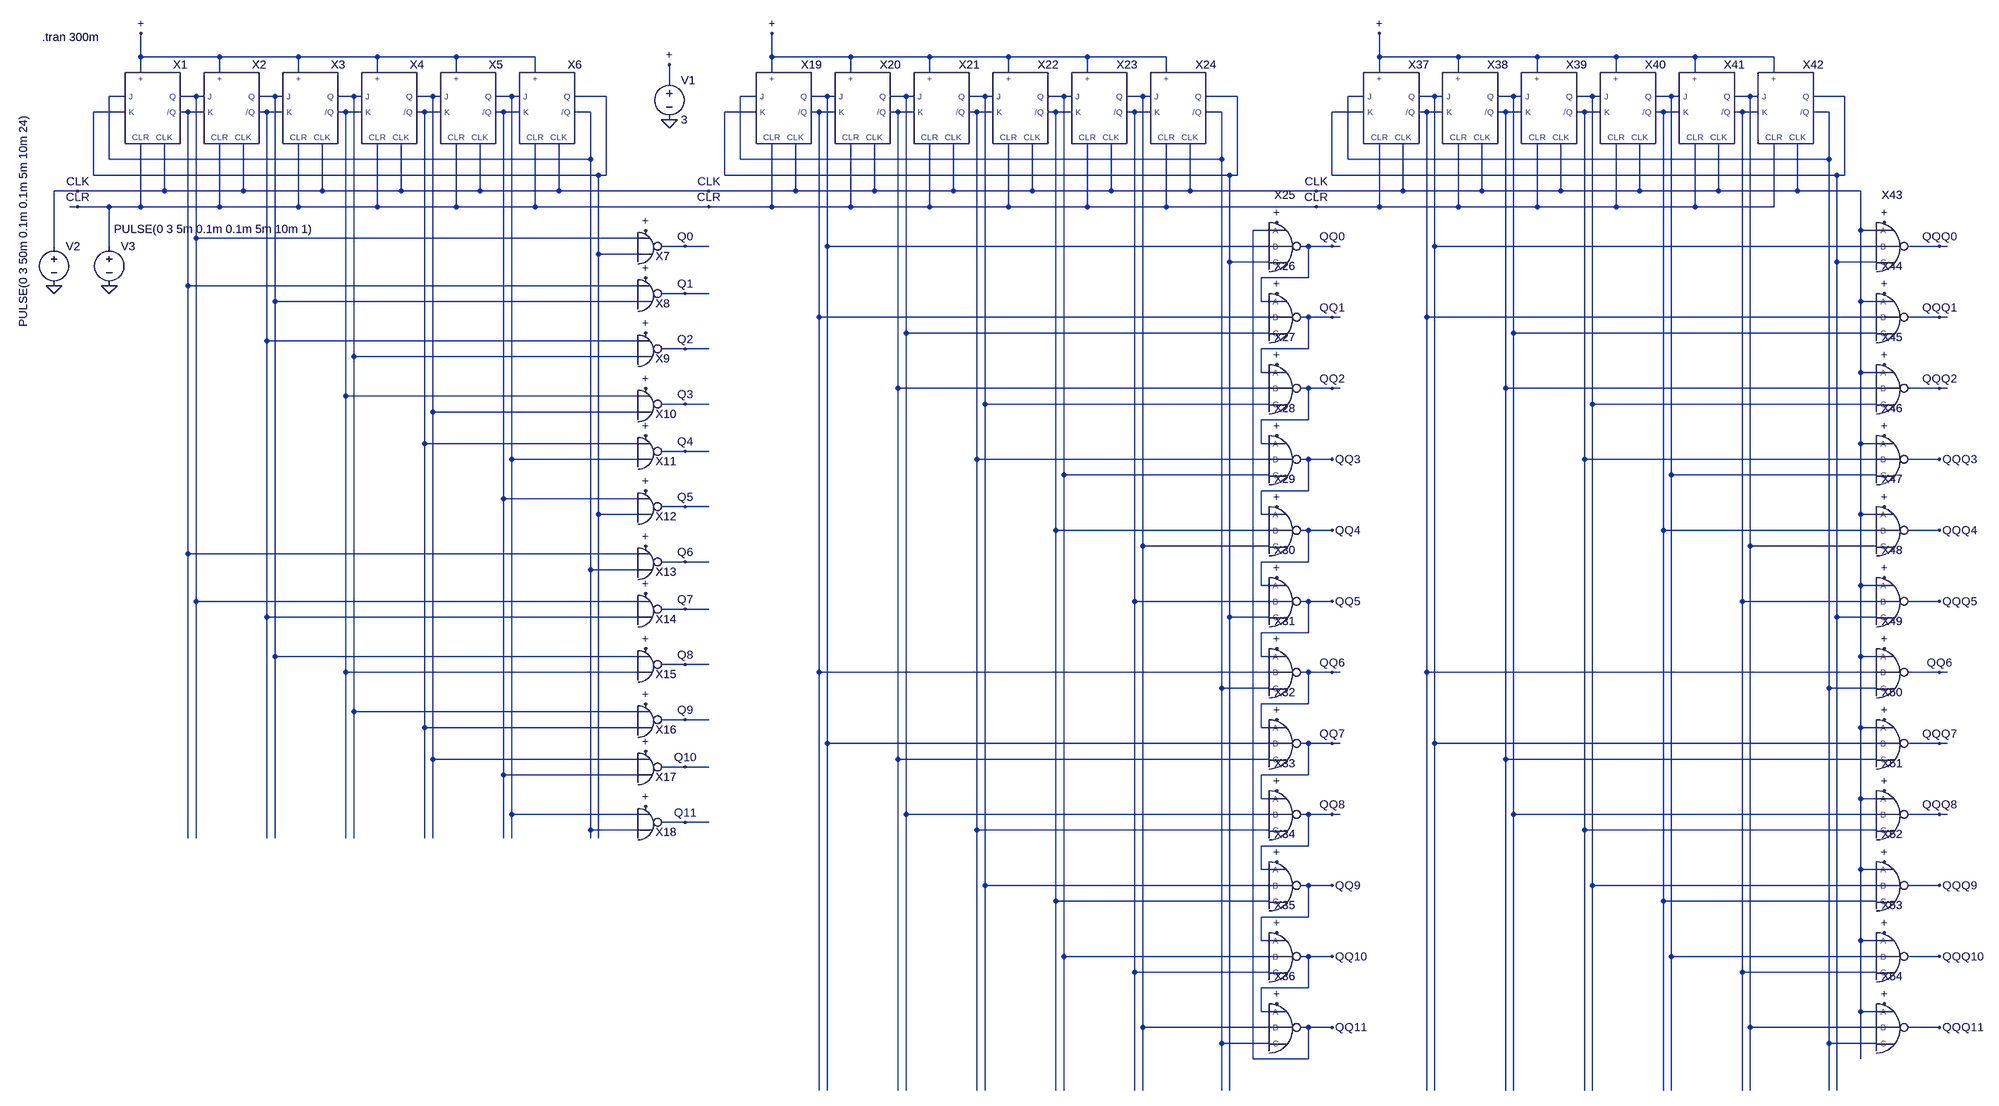
[diagram p0: schematic Jonsson12.asc]
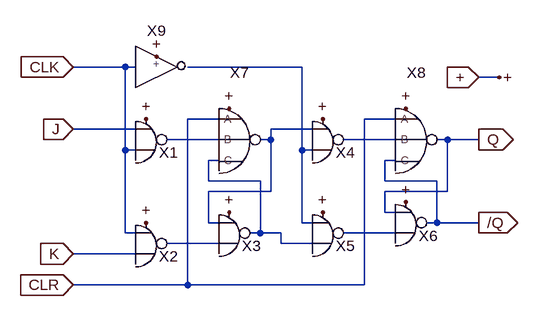
[diagram p1: sub-circuit jonsson.asc]
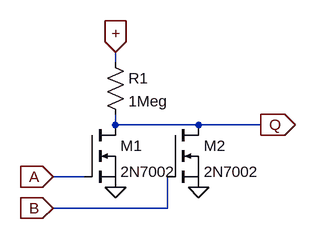
[diagram p2: sub-circuit nor2.asc]
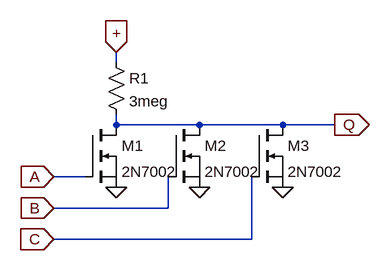
[diagram p3: sub-circuit nor3.asc]
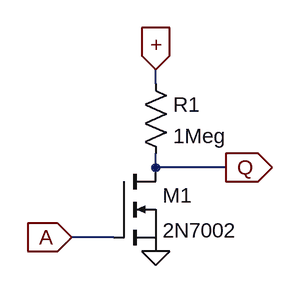
[diagram p4: sub-circuit inv.asc]
Jonsson12.asc, the LTspice schematic file:
Version 4
SHEET 1 3916 2276
WIRE 176 176 176 128
WIRE 336 176 176 176
WIRE 496 176 336 176
WIRE 656 176 496 176
WIRE 816 176 656 176
WIRE 976 176 816 176
WIRE 1456 176 1456 128
WIRE 1616 176 1456 176
WIRE 1776 176 1616 176
WIRE 1936 176 1776 176
WIRE 2096 176 1936 176
WIRE 2256 176 2096 176
WIRE 2688 176 2688 128
WIRE 2848 176 2688 176
WIRE 3008 176 2848 176
WIRE 3168 176 3008 176
WIRE 3328 176 3168 176
WIRE 3488 176 3328 176
WIRE 176 208 176 176
WIRE 336 208 336 176
WIRE 496 208 496 176
WIRE 656 208 656 176
WIRE 816 208 816 176
WIRE 976 208 976 176
WIRE 1456 208 1456 176
WIRE 1616 208 1616 176
WIRE 1776 208 1776 176
WIRE 1936 208 1936 176
WIRE 2096 208 2096 176
WIRE 2256 208 2256 176
WIRE 2688 208 2688 176
WIRE 2848 208 2848 176
WIRE 3008 208 3008 176
WIRE 3168 208 3168 176
WIRE 3328 208 3328 176
WIRE 3488 208 3488 176
WIRE 1248 224 1248 192
WIRE 144 256 112 256
WIRE 288 256 256 256
WIRE 304 256 288 256
WIRE 448 256 416 256
WIRE 464 256 448 256
WIRE 608 256 576 256
WIRE 624 256 608 256
WIRE 768 256 736 256
WIRE 784 256 768 256
WIRE 928 256 896 256
WIRE 944 256 928 256
WIRE 1120 256 1056 256
WIRE 1424 256 1392 256
WIRE 1568 256 1536 256
WIRE 1584 256 1568 256
WIRE 1728 256 1696 256
WIRE 1744 256 1728 256
WIRE 1888 256 1856 256
WIRE 1904 256 1888 256
WIRE 2048 256 2016 256
WIRE 2064 256 2048 256
WIRE 2208 256 2176 256
WIRE 2224 256 2208 256
WIRE 2400 256 2336 256
WIRE 2656 256 2624 256
WIRE 2800 256 2768 256
WIRE 2816 256 2800 256
WIRE 2960 256 2928 256
WIRE 2976 256 2960 256
WIRE 3120 256 3088 256
WIRE 3136 256 3120 256
WIRE 3280 256 3248 256
WIRE 3296 256 3280 256
WIRE 3440 256 3408 256
WIRE 3456 256 3440 256
WIRE 3632 256 3568 256
WIRE 144 288 80 288
WIRE 272 288 256 288
WIRE 304 288 272 288
WIRE 432 288 416 288
WIRE 464 288 432 288
WIRE 592 288 576 288
WIRE 624 288 592 288
WIRE 752 288 736 288
WIRE 784 288 752 288
WIRE 912 288 896 288
WIRE 944 288 912 288
WIRE 1088 288 1056 288
WIRE 1424 288 1360 288
WIRE 1552 288 1536 288
WIRE 1584 288 1552 288
WIRE 1712 288 1696 288
WIRE 1744 288 1712 288
WIRE 1872 288 1856 288
WIRE 1904 288 1872 288
WIRE 2032 288 2016 288
WIRE 2064 288 2032 288
WIRE 2192 288 2176 288
WIRE 2224 288 2192 288
WIRE 2368 288 2336 288
WIRE 2656 288 2592 288
WIRE 2784 288 2768 288
WIRE 2816 288 2784 288
WIRE 2944 288 2928 288
WIRE 2976 288 2944 288
WIRE 3104 288 3088 288
WIRE 3136 288 3104 288
WIRE 3264 288 3248 288
WIRE 3296 288 3264 288
WIRE 3424 288 3408 288
WIRE 3456 288 3424 288
WIRE 3600 288 3568 288
WIRE 112 384 112 256
WIRE 1088 384 1088 288
WIRE 1088 384 112 384
WIRE 1392 384 1392 256
WIRE 2368 384 2368 288
WIRE 2368 384 1392 384
WIRE 2624 384 2624 256
WIRE 3600 384 3600 288
WIRE 3600 384 2624 384
WIRE 80 416 80 288
WIRE 1104 416 80 416
WIRE 1120 416 1120 256
WIRE 1120 416 1104 416
WIRE 1360 416 1360 288
WIRE 2384 416 1360 416
WIRE 2400 416 2400 256
WIRE 2400 416 2384 416
WIRE 2592 416 2592 288
WIRE 3616 416 2592 416
WIRE 3632 416 3632 256
WIRE 3632 416 3616 416
WIRE 48 448 0 448
WIRE 224 448 224 352
WIRE 224 448 48 448
WIRE 384 448 384 352
WIRE 384 448 224 448
WIRE 544 448 544 352
WIRE 544 448 384 448
WIRE 704 448 704 352
WIRE 704 448 544 448
WIRE 864 448 864 352
WIRE 864 448 704 448
WIRE 1024 448 1024 352
WIRE 1024 448 864 448
WIRE 1328 448 1024 448
WIRE 1504 448 1504 352
WIRE 1504 448 1328 448
WIRE 1664 448 1664 352
WIRE 1664 448 1504 448
WIRE 1824 448 1824 352
WIRE 1824 448 1664 448
WIRE 1984 448 1984 352
WIRE 1984 448 1824 448
WIRE 2144 448 2144 352
WIRE 2144 448 1984 448
WIRE 2304 448 2304 352
WIRE 2304 448 2144 448
WIRE 2560 448 2304 448
WIRE 2736 448 2736 352
WIRE 2736 448 2560 448
WIRE 2896 448 2896 352
WIRE 2896 448 2736 448
WIRE 3056 448 3056 352
WIRE 3056 448 2896 448
WIRE 3216 448 3216 352
WIRE 3216 448 3056 448
WIRE 3376 448 3376 352
WIRE 3376 448 3216 448
WIRE 3536 448 3536 352
WIRE 3536 448 3376 448
WIRE 3664 448 3536 448
WIRE 48 480 32 480
WIRE 112 480 48 480
WIRE 176 480 176 352
WIRE 176 480 112 480
WIRE 336 480 336 352
WIRE 336 480 176 480
WIRE 496 480 496 352
WIRE 496 480 336 480
WIRE 656 480 656 352
WIRE 656 480 496 480
WIRE 816 480 816 352
WIRE 816 480 656 480
WIRE 976 480 976 352
WIRE 976 480 816 480
WIRE 1328 480 976 480
WIRE 1456 480 1456 352
WIRE 1456 480 1328 480
WIRE 1616 480 1616 352
WIRE 1616 480 1456 480
WIRE 1776 480 1776 352
WIRE 1776 480 1616 480
WIRE 1936 480 1936 352
WIRE 1936 480 1776 480
WIRE 2096 480 2096 352
WIRE 2096 480 1936 480
WIRE 2256 480 2256 352
WIRE 2256 480 2096 480
WIRE 2560 480 2256 480
WIRE 2688 480 2688 352
WIRE 2688 480 2560 480
WIRE 2848 480 2848 352
WIRE 2848 480 2688 480
WIRE 3008 480 3008 352
WIRE 3008 480 2848 480
WIRE 3168 480 3168 352
WIRE 3168 480 3008 480
WIRE 3328 480 3328 352
WIRE 3328 480 3168 480
WIRE 3488 480 3488 352
WIRE 3488 480 3328 480
WIRE 2464 528 2432 528
WIRE 3664 528 3664 448
WIRE 3696 528 3664 528
WIRE 288 544 288 256
WIRE 1184 544 288 544
WIRE 0 560 0 448
WIRE 112 560 112 480
WIRE 1280 560 1232 560
WIRE 1328 560 1280 560
WIRE 1568 560 1568 256
WIRE 2464 560 1568 560
WIRE 2544 560 2528 560
WIRE 2592 560 2544 560
WIRE 2608 560 2592 560
WIRE 2800 560 2800 256
WIRE 3696 560 2800 560
WIRE 3824 560 3760 560
WIRE 3840 560 3824 560
WIRE 1104 576 1104 416
WIRE 1184 576 1104 576
WIRE 2384 592 2384 416
WIRE 2464 592 2384 592
WIRE 3616 592 3616 416
WIRE 3696 592 3616 592
WIRE 2544 624 2544 560
WIRE 2544 624 2448 624
WIRE 272 640 272 288
WIRE 1184 640 272 640
WIRE 1280 656 1232 656
WIRE 1328 656 1280 656
WIRE 448 672 448 256
WIRE 1184 672 448 672
WIRE 2448 672 2448 624
WIRE 2464 672 2448 672
WIRE 3664 672 3664 528
WIRE 3696 672 3664 672
WIRE 1552 704 1552 288
WIRE 2464 704 1552 704
WIRE 2544 704 2528 704
WIRE 2592 704 2544 704
WIRE 2608 704 2592 704
WIRE 2784 704 2784 288
WIRE 3696 704 2784 704
WIRE 3824 704 3760 704
WIRE 3840 704 3824 704
WIRE 1728 736 1728 256
WIRE 2464 736 1728 736
WIRE 2960 736 2960 256
WIRE 3696 736 2960 736
WIRE 432 752 432 288
WIRE 1184 752 432 752
WIRE 1280 768 1232 768
WIRE 1328 768 1280 768
WIRE 2544 768 2544 704
WIRE 2544 768 2448 768
WIRE 608 784 608 256
WIRE 1184 784 608 784
WIRE 2448 816 2448 768
WIRE 2464 816 2448 816
WIRE 3664 816 3664 672
WIRE 3696 816 3664 816
WIRE 1712 848 1712 288
WIRE 2464 848 1712 848
WIRE 2544 848 2528 848
WIRE 2592 848 2544 848
WIRE 2608 848 2592 848
WIRE 2944 848 2944 288
WIRE 3696 848 2944 848
WIRE 3824 848 3760 848
WIRE 3840 848 3824 848
WIRE 592 864 592 288
WIRE 1184 864 592 864
WIRE 1280 880 1232 880
WIRE 1328 880 1280 880
WIRE 1888 880 1888 256
WIRE 2464 880 1888 880
WIRE 3120 880 3120 256
WIRE 3696 880 3120 880
WIRE 768 896 768 256
WIRE 1184 896 768 896
WIRE 2544 912 2544 848
WIRE 2544 912 2448 912
WIRE 752 960 752 288
WIRE 1184 960 752 960
WIRE 2448 960 2448 912
WIRE 2464 960 2448 960
WIRE 3664 960 3664 816
WIRE 3696 960 3664 960
WIRE 1280 976 1232 976
WIRE 1328 976 1280 976
WIRE 928 992 928 256
WIRE 1184 992 928 992
WIRE 1872 992 1872 288
WIRE 2464 992 1872 992
WIRE 2544 992 2528 992
WIRE 2592 992 2544 992
WIRE 3104 992 3104 288
WIRE 3696 992 3104 992
WIRE 3824 992 3760 992
WIRE 2048 1024 2048 256
WIRE 2464 1024 2048 1024
WIRE 3280 1024 3280 256
WIRE 3696 1024 3280 1024
WIRE 2544 1056 2544 992
WIRE 2544 1056 2448 1056
WIRE 912 1072 912 288
WIRE 1184 1072 912 1072
WIRE 1280 1088 1232 1088
WIRE 1328 1088 1280 1088
WIRE 1104 1104 1104 576
WIRE 1184 1104 1104 1104
WIRE 2448 1104 2448 1056
WIRE 2464 1104 2448 1104
WIRE 3664 1104 3664 960
WIRE 3696 1104 3664 1104
WIRE 2032 1136 2032 288
WIRE 2464 1136 2032 1136
WIRE 2544 1136 2528 1136
WIRE 2592 1136 2544 1136
WIRE 3264 1136 3264 288
WIRE 3696 1136 3264 1136
WIRE 3824 1136 3760 1136
WIRE 2208 1168 2208 256
WIRE 2464 1168 2208 1168
WIRE 3440 1168 3440 256
WIRE 3696 1168 3440 1168
WIRE 272 1184 272 640
WIRE 1184 1184 272 1184
WIRE 1280 1200 1232 1200
WIRE 1328 1200 1280 1200
WIRE 2544 1200 2544 1136
WIRE 2544 1200 2448 1200
WIRE 1088 1216 1088 384
WIRE 1184 1216 1088 1216
WIRE 2448 1248 2448 1200
WIRE 2464 1248 2448 1248
WIRE 3664 1248 3664 1104
WIRE 3696 1248 3664 1248
WIRE 288 1280 288 544
WIRE 1184 1280 288 1280
WIRE 2192 1280 2192 288
WIRE 2464 1280 2192 1280
WIRE 2544 1280 2528 1280
WIRE 2592 1280 2544 1280
WIRE 3424 1280 3424 288
WIRE 3696 1280 3424 1280
WIRE 3824 1280 3760 1280
WIRE 1280 1296 1232 1296
WIRE 1328 1296 1280 1296
WIRE 432 1312 432 752
WIRE 1184 1312 432 1312
WIRE 2384 1312 2384 592
WIRE 2464 1312 2384 1312
WIRE 3616 1312 3616 592
WIRE 3696 1312 3616 1312
WIRE 2544 1344 2544 1280
WIRE 2544 1344 2448 1344
WIRE 448 1392 448 672
WIRE 1184 1392 448 1392
WIRE 2448 1392 2448 1344
WIRE 2464 1392 2448 1392
WIRE 3664 1392 3664 1248
WIRE 3696 1392 3664 1392
WIRE 1280 1408 1232 1408
WIRE 1328 1408 1280 1408
WIRE 592 1424 592 864
WIRE 1184 1424 592 1424
WIRE 1552 1424 1552 704
WIRE 2464 1424 1552 1424
WIRE 2544 1424 2528 1424
WIRE 2592 1424 2544 1424
WIRE 2608 1424 2592 1424
WIRE 2784 1424 2784 704
WIRE 3696 1424 2784 1424
WIRE 3824 1424 3760 1424
WIRE 3840 1424 3824 1424
WIRE 2368 1456 2368 384
WIRE 2464 1456 2368 1456
WIRE 3600 1456 3600 384
WIRE 3696 1456 3600 1456
WIRE 2544 1488 2544 1424
WIRE 2544 1488 2448 1488
WIRE 608 1504 608 784
WIRE 1184 1504 608 1504
WIRE 1280 1520 1232 1520
WIRE 1328 1520 1280 1520
WIRE 752 1536 752 960
WIRE 1184 1536 752 1536
WIRE 2448 1536 2448 1488
WIRE 2464 1536 2448 1536
WIRE 3664 1536 3664 1392
WIRE 3696 1536 3664 1536
WIRE 1568 1568 1568 560
WIRE 2464 1568 1568 1568
WIRE 2544 1568 2528 1568
WIRE 2592 1568 2544 1568
WIRE 2608 1568 2592 1568
WIRE 2800 1568 2800 560
WIRE 3696 1568 2800 1568
WIRE 3824 1568 3760 1568
WIRE 3840 1568 3824 1568
WIRE 768 1600 768 896
WIRE 1184 1600 768 1600
WIRE 1712 1600 1712 848
WIRE 2464 1600 1712 1600
WIRE 2944 1600 2944 848
WIRE 3696 1600 2944 1600
WIRE 1280 1616 1232 1616
WIRE 1328 1616 1280 1616
WIRE 912 1632 912 1072
WIRE 1184 1632 912 1632
WIRE 2544 1632 2544 1568
WIRE 2544 1632 2448 1632
WIRE 2448 1680 2448 1632
WIRE 2464 1680 2448 1680
WIRE 3664 1680 3664 1536
WIRE 3696 1680 3664 1680
WIRE 928 1712 928 992
WIRE 1184 1712 928 1712
WIRE 1728 1712 1728 736
WIRE 2464 1712 1728 1712
WIRE 2544 1712 2528 1712
WIRE 2592 1712 2544 1712
WIRE 2608 1712 2592 1712
WIRE 2960 1712 2960 736
WIRE 3696 1712 2960 1712
WIRE 3824 1712 3760 1712
WIRE 3840 1712 3824 1712
WIRE 1280 1728 1232 1728
WIRE 1328 1728 1280 1728
WIRE 1088 1744 1088 1216
WIRE 1184 1744 1088 1744
WIRE 1872 1744 1872 992
WIRE 2464 1744 1872 1744
WIRE 3104 1744 3104 992
WIRE 3696 1744 3104 1744
WIRE 272 1760 272 1184
WIRE 288 1760 288 1280
WIRE 432 1760 432 1312
WIRE 448 1760 448 1392
WIRE 592 1760 592 1424
WIRE 608 1760 608 1504
WIRE 752 1760 752 1536
WIRE 768 1760 768 1600
WIRE 912 1760 912 1632
WIRE 928 1760 928 1712
WIRE 1088 1760 1088 1744
WIRE 1104 1760 1104 1104
WIRE 2544 1776 2544 1712
WIRE 2544 1776 2448 1776
WIRE 2448 1824 2448 1776
WIRE 2464 1824 2448 1824
WIRE 3664 1824 3664 1680
WIRE 3696 1824 3664 1824
WIRE 1888 1856 1888 880
WIRE 2464 1856 1888 1856
WIRE 2544 1856 2528 1856
WIRE 2592 1856 2544 1856
WIRE 3120 1856 3120 880
WIRE 3696 1856 3120 1856
WIRE 3824 1856 3760 1856
WIRE 2032 1888 2032 1136
WIRE 2464 1888 2032 1888
WIRE 3264 1888 3264 1136
WIRE 3696 1888 3264 1888
WIRE 2544 1920 2544 1856
WIRE 2544 1920 2448 1920
WIRE 2448 1968 2448 1920
WIRE 2464 1968 2448 1968
WIRE 3664 1968 3664 1824
WIRE 3696 1968 3664 1968
WIRE 2048 2000 2048 1024
WIRE 2464 2000 2048 2000
WIRE 2544 2000 2528 2000
WIRE 2592 2000 2544 2000
WIRE 3280 2000 3280 1024
WIRE 3696 2000 3280 2000
WIRE 3824 2000 3760 2000
WIRE 2192 2032 2192 1280
WIRE 2464 2032 2192 2032
WIRE 3424 2032 3424 1280
WIRE 3696 2032 3424 2032
WIRE 2544 2064 2544 2000
WIRE 2544 2064 2448 2064
WIRE 2448 2112 2448 2064
WIRE 2464 2112 2448 2112
WIRE 3664 2112 3664 1968
WIRE 3696 2112 3664 2112
WIRE 2208 2144 2208 1168
WIRE 2464 2144 2208 2144
WIRE 2544 2144 2528 2144
WIRE 2592 2144 2544 2144
WIRE 3440 2144 3440 1168
WIRE 3696 2144 3440 2144
WIRE 3824 2144 3760 2144
WIRE 2368 2176 2368 1456
WIRE 2464 2176 2368 2176
WIRE 3600 2176 3600 1456
WIRE 3696 2176 3600 2176
WIRE 2432 2208 2432 528
WIRE 2544 2208 2544 2144
WIRE 2544 2208 2432 2208
WIRE 3664 2208 3664 2112
WIRE 1552 2272 1552 1424
WIRE 1568 2272 1568 1568
WIRE 1712 2272 1712 1600
WIRE 1728 2272 1728 1712
WIRE 1872 2272 1872 1744
WIRE 1888 2272 1888 1856
WIRE 2032 2272 2032 1888
WIRE 2048 2272 2048 2000
WIRE 2192 2272 2192 2032
WIRE 2208 2272 2208 2144
WIRE 2368 2272 2368 2176
WIRE 2384 2272 2384 1312
WIRE 2784 2272 2784 1424
WIRE 2800 2272 2800 1568
WIRE 2944 2272 2944 1600
WIRE 2960 2272 2960 1712
WIRE 3104 2272 3104 1744
WIRE 3120 2272 3120 1856
WIRE 3264 2272 3264 1888
WIRE 3280 2272 3280 2000
WIRE 3424 2272 3424 2032
WIRE 3440 2272 3440 2144
WIRE 3600 2272 3600 2176
WIRE 3616 2272 3616 1312
FLAG 176 128 +
FLAG 1248 304 0
FLAG 0 640 0
FLAG 112 640 0
FLAG 48 448 CLK
FLAG 48 480 CLR
FLAG 1200 528 +
FLAG 1200 624 +
FLAG 1200 736 +
FLAG 1280 560 Q0
FLAG 1280 656 Q1
FLAG 1280 768 Q2
FLAG 1200 848 +
FLAG 1200 944 +
FLAG 1200 1056 +
FLAG 1280 880 Q3
FLAG 1280 976 Q4
FLAG 1280 1088 Q5
FLAG 1200 1168 +
FLAG 1200 1264 +
FLAG 1200 1376 +
FLAG 1280 1200 Q6
FLAG 1280 1296 Q7
FLAG 1280 1408 Q8
FLAG 1200 1488 +
FLAG 1200 1584 +
FLAG 1200 1696 +
FLAG 1280 1520 Q9
FLAG 1280 1616 Q10
FLAG 1280 1728 Q11
FLAG 1248 192 +
FLAG 1456 128 +
FLAG 1328 448 CLK
FLAG 1328 480 CLR
FLAG 2480 512 +
FLAG 2480 656 +
FLAG 2480 800 +
FLAG 2592 560 QQ0
FLAG 2592 704 QQ1
FLAG 2592 848 QQ2
FLAG 2480 944 +
FLAG 2480 1088 +
FLAG 2480 1232 +
FLAG 2592 992 QQ3
FLAG 2592 1136 QQ4
FLAG 2592 1280 QQ5
FLAG 2480 1376 +
FLAG 2480 1520 +
FLAG 2480 1664 +
FLAG 2592 1424 QQ6
FLAG 2592 1568 QQ7
FLAG 2592 1712 QQ8
FLAG 2480 1808 +
FLAG 2480 1952 +
FLAG 2480 2096 +
FLAG 2592 1856 QQ9
FLAG 2592 2000 QQ10
FLAG 2592 2144 QQ11
FLAG 2688 128 +
FLAG 2560 448 CLK
FLAG 2560 480 CLR
FLAG 3712 512 +
FLAG 3712 656 +
FLAG 3712 800 +
FLAG 3824 560 QQQ0
FLAG 3824 704 QQQ1
FLAG 3824 848 QQQ2
FLAG 3712 944 +
FLAG 3712 1088 +
FLAG 3712 1232 +
FLAG 3824 992 QQQ3
FLAG 3824 1136 QQQ4
FLAG 3824 1280 QQQ5
FLAG 3712 1376 +
FLAG 3712 1520 +
FLAG 3712 1664 +
FLAG 3824 1424 QQ6
FLAG 3824 1568 QQQ7
FLAG 3824 1712 QQQ8
FLAG 3712 1808 +
FLAG 3712 1952 +
FLAG 3712 2096 +
FLAG 3824 1856 QQQ9
FLAG 3824 2000 QQQ10
FLAG 3824 2144 QQQ11
SYMBOL Jonsson 192 288 R0
SYMATTR InstName X1
SYMBOL Jonsson 352 288 R0
SYMATTR InstName X2
SYMBOL Jonsson 512 288 R0
SYMATTR InstName X3
SYMBOL Jonsson 672 288 R0
SYMATTR InstName X4
SYMBOL Jonsson 832 288 R0
SYMATTR InstName X5
SYMBOL Jonsson 992 288 R0
SYMATTR InstName X6
SYMBOL voltage 1248 208 R0
SYMATTR InstName V1
SYMATTR Value 3
SYMBOL voltage 0 544 R0
WINDOW 3 -62 -252 VRight 2
SYMATTR InstName V2
SYMATTR Value PULSE(0 3 50m 0.1m 0.1m 5m 10m 24)
SYMBOL voltage 112 544 R0
WINDOW 3 10 -19 Left 2
SYMATTR InstName V3
SYMATTR Value PULSE(0 3 5m 0.1m 0.1m 5m 10m 1)
SYMBOL NOR2 1216 560 R0
SYMATTR InstName X7
SYMBOL NOR2 1216 656 R0
SYMATTR InstName X8
SYMBOL NOR2 1216 768 R0
SYMATTR InstName X9
SYMBOL NOR2 1216 880 R0
SYMATTR InstName X10
SYMBOL NOR2 1216 976 R0
SYMATTR InstName X11
SYMBOL NOR2 1216 1088 R0
SYMATTR InstName X12
SYMBOL NOR2 1216 1200 R0
SYMATTR InstName X13
SYMBOL NOR2 1216 1296 R0
SYMATTR InstName X14
SYMBOL NOR2 1216 1408 R0
SYMATTR InstName X15
SYMBOL NOR2 1216 1520 R0
SYMATTR InstName X16
SYMBOL NOR2 1216 1616 R0
SYMATTR InstName X17
SYMBOL NOR2 1216 1728 R0
SYMATTR InstName X18
SYMBOL Jonsson 1472 288 R0
SYMATTR InstName X19
SYMBOL Jonsson 1632 288 R0
SYMATTR InstName X20
SYMBOL Jonsson 1792 288 R0
SYMATTR InstName X21
SYMBOL Jonsson 1952 288 R0
SYMATTR InstName X22
SYMBOL Jonsson 2112 288 R0
SYMATTR InstName X23
SYMBOL Jonsson 2272 288 R0
SYMATTR InstName X24
SYMBOL NOR3 2496 560 R0
SYMATTR InstName X25
SYMBOL NOR3 2496 704 R0
SYMATTR InstName X26
SYMBOL NOR3 2496 848 R0
SYMATTR InstName X27
SYMBOL NOR3 2496 992 R0
SYMATTR InstName X28
SYMBOL NOR3 2496 1136 R0
SYMATTR InstName X29
SYMBOL NOR3 2496 1280 R0
SYMATTR InstName X30
SYMBOL NOR3 2496 1424 R0
SYMATTR InstName X31
SYMBOL NOR3 2496 1568 R0
SYMATTR InstName X32
SYMBOL NOR3 2496 1712 R0
SYMATTR InstName X33
SYMBOL NOR3 2496 1856 R0
SYMATTR InstName X34
SYMBOL NOR3 2496 2000 R0
SYMATTR InstName X35
SYMBOL NOR3 2496 2144 R0
SYMATTR InstName X36
SYMBOL Jonsson 2704 288 R0
SYMATTR InstName X37
SYMBOL Jonsson 2864 288 R0
SYMATTR InstName X38
SYMBOL Jonsson 3024 288 R0
SYMATTR InstName X39
SYMBOL Jonsson 3184 288 R0
SYMATTR InstName X40
SYMBOL Jonsson 3344 288 R0
SYMATTR InstName X41
SYMBOL Jonsson 3504 288 R0
SYMATTR InstName X42
SYMBOL NOR3 3728 560 R0
SYMATTR InstName X43
SYMBOL NOR3 3728 704 R0
SYMATTR InstName X44
SYMBOL NOR3 3728 848 R0
SYMATTR InstName X45
SYMBOL NOR3 3728 992 R0
SYMATTR InstName X46
SYMBOL NOR3 3728 1136 R0
SYMATTR InstName X47
SYMBOL NOR3 3728 1280 R0
SYMATTR InstName X48
SYMBOL NOR3 3728 1424 R0
SYMATTR InstName X49
SYMBOL NOR3 3728 1568 R0
SYMATTR InstName X50
SYMBOL NOR3 3728 1712 R0
SYMATTR InstName X51
SYMBOL NOR3 3728 1856 R0
SYMATTR InstName X52
SYMBOL NOR3 3728 2000 R0
SYMATTR InstName X53
SYMBOL NOR3 3728 2144 R0
SYMATTR InstName X54
TEXT -24 136 Left 2 !.tran 300m

jonsson.asc, the sub-circuit schematic file:
Version 4
SHEET 1 880 680
WIRE 176 80 96 80
WIRE 192 80 176 80
WIRE 448 80 272 80
WIRE 752 96 720 96
WIRE 320 160 272 160
WIRE 592 160 544 160
WIRE 192 176 96 176
WIRE 464 176 400 176
WIRE 320 192 240 192
WIRE 400 192 400 176
WIRE 400 192 384 192
WIRE 592 192 512 192
WIRE 672 192 656 192
WIRE 720 192 672 192
WIRE 176 208 176 80
WIRE 192 208 176 208
WIRE 448 208 448 80
WIRE 464 208 448 208
WIRE 320 224 304 224
WIRE 592 224 576 224
WIRE 304 256 304 224
WIRE 384 256 304 256
WIRE 576 256 576 224
WIRE 656 256 576 256
WIRE 400 272 400 192
WIRE 400 272 304 272
WIRE 672 272 672 192
WIRE 672 272 576 272
WIRE 576 304 576 272
WIRE 592 304 576 304
WIRE 304 320 304 272
WIRE 320 320 304 320
WIRE 448 320 448 208
WIRE 464 320 448 320
WIRE 656 320 656 256
WIRE 656 320 640 320
WIRE 720 320 656 320
WIRE 176 336 176 208
WIRE 192 336 176 336
WIRE 384 336 384 256
WIRE 384 336 368 336
WIRE 416 336 384 336
WIRE 592 336 512 336
WIRE 320 352 240 352
WIRE 416 352 416 336
WIRE 464 352 416 352
WIRE 192 368 96 368
WIRE 272 416 272 160
WIRE 272 416 96 416
WIRE 544 416 544 160
WIRE 544 416 272 416
FLAG 224 64 +
FLAG 208 160 +
FLAG 208 320 +
FLAG 336 304 +
FLAG 336 144 +
FLAG 480 160 +
FLAG 480 304 +
FLAG 608 288 +
FLAG 608 144 +
FLAG 96 80 CLK
IOPIN 96 80 In
FLAG 96 176 J
IOPIN 96 176 In
FLAG 96 368 K
IOPIN 96 368 In
FLAG 96 416 CLR
IOPIN 96 416 In
FLAG 720 192 Q
IOPIN 720 192 Out
FLAG 720 320 /Q
IOPIN 720 320 Out
FLAG 720 96 +
IOPIN 720 96 In
FLAG 752 96 +
SYMBOL NOR2 224 192 R0
SYMATTR InstName X1
SYMBOL NOR2 224 352 R0
SYMATTR InstName X2
SYMBOL NOR2 352 336 R0
SYMATTR InstName X3
SYMBOL NOR2 496 192 R0
SYMATTR InstName X4
SYMBOL NOR2 496 336 R0
SYMATTR InstName X5
SYMBOL NOR2 624 320 R0
SYMATTR InstName X6
SYMBOL NOR3 352 192 R0
SYMATTR InstName X7
SYMBOL NOR3 624 192 R0
SYMATTR InstName X8
SYMBOL INV 224 80 R0
SYMATTR InstName X9

nor2.asc, the sub-circuit schematic file:
Version 4
SHEET 1 880 680
WIRE 272 144 272 128
WIRE 272 240 272 224
WIRE 400 240 272 240
WIRE 496 240 400 240
WIRE 224 320 176 320
WIRE 352 368 352 320
WIRE 352 368 176 368
FLAG 272 336 0
FLAG 176 320 A
IOPIN 176 320 In
FLAG 496 240 Q
IOPIN 496 240 Out
FLAG 272 128 +
IOPIN 272 128 In
FLAG 400 336 0
FLAG 176 368 B
IOPIN 176 368 In
SYMBOL nmos 224 240 R0
SYMATTR InstName M1
SYMATTR Value 2N7002
SYMBOL res 256 128 R0
SYMATTR InstName R1
SYMATTR Value 1Meg
SYMBOL nmos 352 240 R0
SYMATTR InstName M2
SYMATTR Value 2N7002

nor3.asc, the sub-circuit schematic file:
Version 4
SHEET 1 880 680
WIRE 272 144 272 128
WIRE 272 240 272 224
WIRE 400 240 272 240
WIRE 528 240 400 240
WIRE 608 240 528 240
WIRE 224 320 176 320
WIRE 352 368 352 320
WIRE 352 368 176 368
WIRE 480 416 480 320
WIRE 480 416 176 416
FLAG 272 336 0
FLAG 176 320 A
IOPIN 176 320 In
FLAG 608 240 Q
IOPIN 608 240 Out
FLAG 272 128 +
IOPIN 272 128 In
FLAG 400 336 0
FLAG 528 336 0
FLAG 176 368 B
IOPIN 176 368 In
FLAG 176 416 C
IOPIN 176 416 In
SYMBOL nmos 224 240 R0
SYMATTR InstName M1
SYMATTR Value 2N7002
SYMBOL res 256 128 R0
SYMATTR InstName R1
SYMATTR Value 3meg
SYMBOL nmos 352 240 R0
SYMATTR InstName M2
SYMATTR Value 2N7002
SYMBOL nmos 480 240 R0
SYMATTR InstName M3
SYMATTR Value 2N7002

inv.asc, the sub-circuit schematic file:
Version 4
SHEET 1 880 680
WIRE 272 144 272 128
WIRE 272 240 272 224
WIRE 352 240 272 240
WIRE 224 320 176 320
FLAG 272 336 0
FLAG 176 320 A
IOPIN 176 320 In
FLAG 352 240 Q
IOPIN 352 240 Out
FLAG 272 128 +
IOPIN 272 128 In
SYMBOL nmos 224 240 R0
SYMATTR InstName M1
SYMATTR Value 2N7002
SYMBOL res 256 128 R0
SYMATTR InstName R1
SYMATTR Value 1Meg

The netlist it stands for:
* Jonsson12.asc
XX1 + CLK CLR N001 N007 N022 N002 jonsson
XX2 + CLK CLR N002 N022 N023 N003 jonsson
XX3 + CLK CLR N003 N023 N024 N004 jonsson
XX4 + CLK CLR N004 N024 N025 N005 jonsson
XX5 + CLK CLR N005 N025 N026 N006 jonsson
XX6 + CLK CLR N006 N026 N001 N007 jonsson
V1 + 0 3
V2 CLK 0 PULSE(0 3 50m 0.1m 0.1m 5m 10m 24)
V3 CLR 0 PULSE(0 3 5m 0.1m 0.1m 5m 10m 1)
XX7 + N002 N007 Q0 nor2
XX8 + N022 N003 Q1 nor2
XX9 + N023 N004 Q2 nor2
XX10 + N024 N005 Q3 nor2
XX11 + N025 N006 Q4 nor2
XX12 + N026 N007 Q5 nor2
XX13 + N022 N001 Q6 nor2
XX14 + N002 N023 Q7 nor2
XX15 + N003 N024 Q8 nor2
XX16 + N004 N025 Q9 nor2
XX17 + N005 N026 Q10 nor2
XX18 + N006 N001 Q11 nor2
XX19 + CLK CLR N008 N014 N027 N009 jonsson
XX20 + CLK CLR N009 N027 N028 N010 jonsson
XX21 + CLK CLR N010 N028 N029 N011 jonsson
XX22 + CLK CLR N011 N029 N030 N012 jonsson
XX23 + CLK CLR N012 N030 N031 N013 jonsson
XX24 + CLK CLR N013 N031 N008 N014 jonsson
XX25 + QQ11 N009 N014 QQ0 nor3
XX26 + QQ0 N027 N010 QQ1 nor3
XX27 + QQ1 N028 N011 QQ2 nor3
XX28 + QQ2 N029 N012 QQ3 nor3
XX29 + QQ3 N030 N013 QQ4 nor3
XX30 + QQ4 N031 N014 QQ5 nor3
XX31 + QQ5 N027 N008 QQ6 nor3
XX32 + QQ6 N009 N028 QQ7 nor3
XX33 + QQ7 N010 N029 QQ8 nor3
XX34 + QQ8 N011 N030 QQ9 nor3
XX35 + QQ9 N012 N031 QQ10 nor3
XX36 + QQ10 N013 N008 QQ11 nor3
XX37 + CLK CLR N015 N021 N032 N016 jonsson
XX38 + CLK CLR N016 N032 N033 N017 jonsson
XX39 + CLK CLR N017 N033 N034 N018 jonsson
XX40 + CLK CLR N018 N034 N035 N019 jonsson
XX41 + CLK CLR N019 N035 N036 N020 jonsson
XX42 + CLK CLR N020 N036 N015 N021 jonsson
XX43 + CLK N016 N021 QQQ0 nor3
XX44 + CLK N032 N017 QQQ1 nor3
XX45 + CLK N033 N018 QQQ2 nor3
XX46 + CLK N034 N019 QQQ3 nor3
XX47 + CLK N035 N020 QQQ4 nor3
XX48 + CLK N036 N021 QQQ5 nor3
XX49 + CLK N032 N015 QQ6 nor3
XX50 + CLK N016 N033 QQQ7 nor3
XX51 + CLK N017 N034 QQQ8 nor3
XX52 + CLK N018 N035 QQQ9 nor3
XX53 + CLK N019 N036 QQQ10 nor3
XX54 + CLK N020 N015 QQQ11 nor3

* block symbol definitions
.subckt jonsson + CLK CLR J K /Q Q
XX1 + J CLK N003 nor2
XX2 + CLK K N007 nor2
XX3 + N002 N007 N005 nor2
XX4 + N002 N001 N004 nor2
XX5 + N001 N005 N006 nor2
XX6 + Q N006 /Q nor2
XX7 + CLR N003 N005 N002 nor3
XX8 + CLR N004 /Q Q nor3
XX9 + CLK N001 inv
.ends jonsson

.subckt nor2 + A B Q
M1 Q A 0 0 2N7002
R1 + Q 1Meg
M2 Q B 0 0 2N7002
.ends nor2

.subckt nor3 + A B C Q
M1 Q A 0 0 2N7002
R1 + Q 3meg
M2 Q B 0 0 2N7002
M3 Q C 0 0 2N7002
.ends nor3

.subckt inv + A Q
M1 Q A 0 0 2N7002
R1 + Q 1Meg
.ends inv

.model NMOS NMOS
.model PMOS PMOS
.lib standard.mos
.tran 300m
.backanno
.end